# Altium schematic sheet Backplane PCB Connector.SchDoc: CUBESAT BACKPLANE PCB CONNECTOR
size B; CompanyName: ENGINEERING & TECHNICAL SERVICES; DrawnBy: C. Kornowski; Engineer: C. Kornowski; Organization: TECHNOLOGY DEVELOPMENT & ENGINEERING CENTER; Address1: 11401 HOOVER ROAD; Address2: MILAN, OH  44846; DocumentNumber: RD17-7000; Revision: INIT; SheetNumber: 2; SheetTotal: 5; PageSetup: Record=PageOptions|CenterHorizontal=True|CenterVertical=True|PrintScale=1.09|XCorrection=1.00|YCorrection=1.00|PrintKind=1|BorderSize=5000000|LeftOffset=0|BottomOffset=0|Orientation=2|PaperLength=1000|PaperWidth=1000|Scale=100|PaperSource=7|PrintQuality=600|MediaType=1|DitherType=10|PaperKind=11x17|PrintScaleMode=1
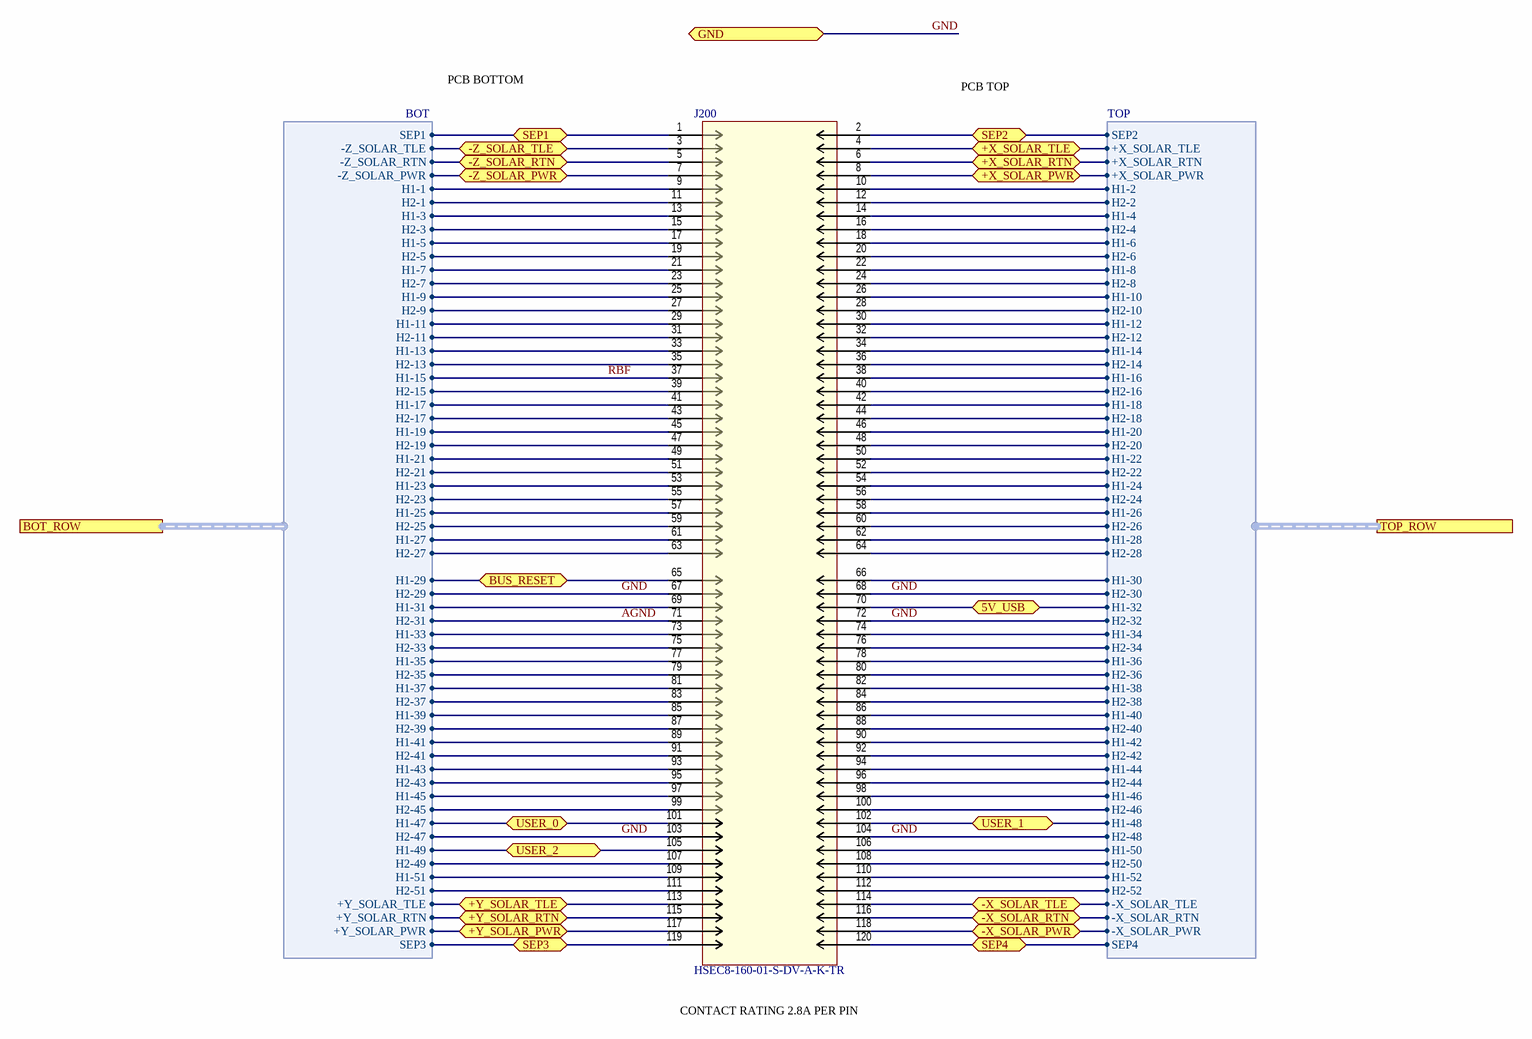
[diagram p0: Backplane PCB Connector.SchDoc]

## Parts
J200  HSEC8-160-01-S-DV-A-K-TR  [HSEC8-160-01-S-DV-A-K-TR]

## Ports
5V_USB (bidir), +X_SOLAR_PWR (bidir), +X_SOLAR_RTN (bidir), +X_SOLAR_TLE (bidir), +Y_SOLAR_PWR (bidir), +Y_SOLAR_RTN (bidir), +Y_SOLAR_TLE (bidir), -X_SOLAR_PWR (bidir), -X_SOLAR_RTN (bidir), -X_SOLAR_TLE (bidir), -Z_SOLAR_PWR (bidir), -Z_SOLAR_RTN (bidir), -Z_SOLAR_TLE (bidir), BOT_ROW (harness BOT), BUS_RESET (bidir), GND (bidir), SEP1 (bidir), SEP2 (bidir), SEP3 (bidir), SEP4 (bidir), TOP_ROW (harness TOP), USER_0 (bidir), USER_1 (bidir), USER_2 (bidir)

## Harnesses
BOT: H1-1, H2-1, H1-3, H2-3, H1-5, H2-5, H1-7, H2-7, H1-9, H2-9, H1-11, H2-11, H1-13, H2-13, H1-15, H2-15, H1-17, H2-17, H1-19, H2-19, H1-21, H2-21, H1-23, H2-23, H1-25, H2-25, H1-27, H2-27, H1-29, H2-29, H1-31, H2-31, H2-33, H1-33, H2-35, H1-35, H2-37, H1-37, H2-39, H1-39, H2-41, H1-41, H2-43, H1-43, H2-45, H1-45, H2-47, H1-47, H2-49, H1-49, H2-51, H1-51, SEP1, SEP3, +Y_SOLAR_PWR, +Y_SOLAR_RTN, +Y_SOLAR_TLE, -Z_SOLAR_PWR, -Z_SOLAR_RTN, -Z_SOLAR_TLE
TOP: H1-2, H2-2, H1-4, H2-4, H1-6, H2-6, H1-8, H2-8, H1-10, H2-10, H1-12, H2-12, H1-14, H2-14, H1-16, H2-16, H1-18, H2-18, H1-20, H2-20, H1-22, H2-22, H1-24, H2-24, H1-26, H2-26, H1-28, H2-28, H1-30, H2-30, H2-32, H1-32, H2-34, H1-34, H2-36, H1-36, H2-38, H1-38, H2-40, H1-40, H2-42, H1-42, H2-44, H1-44, H2-46, H1-46, H2-48, H1-48, H2-50, H1-50, H2-52, H1-52, SEP2, SEP4, -X_SOLAR_PWR, -X_SOLAR_RTN, -X_SOLAR_TLE, +X_SOLAR_TLE, +X_SOLAR_RTN, +X_SOLAR_PWR

## Nets
5V_USB: J200.70 ; port 5V_USB, port TOP_ROW.H1-32
+X_SOLAR_PWR: J200.8 ; port +X_SOLAR_PWR, port TOP_ROW.+X_SOLAR_PWR
+X_SOLAR_RTN: J200.6 ; port +X_SOLAR_RTN, port TOP_ROW.+X_SOLAR_RTN
+X_SOLAR_TLE: J200.4 ; port +X_SOLAR_TLE, port TOP_ROW.+X_SOLAR_TLE
+Y_SOLAR_PWR: J200.117 ; port +Y_SOLAR_PWR, port BOT_ROW.+Y_SOLAR_PWR
+Y_SOLAR_RTN: J200.115 ; port +Y_SOLAR_RTN, port BOT_ROW.+Y_SOLAR_RTN
+Y_SOLAR_TLE: J200.113 ; port +Y_SOLAR_TLE, port BOT_ROW.+Y_SOLAR_TLE
-X_SOLAR_PWR: J200.118 ; port -X_SOLAR_PWR, port TOP_ROW.-X_SOLAR_PWR
-X_SOLAR_RTN: J200.116 ; port -X_SOLAR_RTN, port TOP_ROW.-X_SOLAR_RTN
-X_SOLAR_TLE: J200.114 ; port -X_SOLAR_TLE, port TOP_ROW.-X_SOLAR_TLE
-Z_SOLAR_PWR: J200.7 ; port -Z_SOLAR_PWR, port BOT_ROW.-Z_SOLAR_PWR
-Z_SOLAR_RTN: J200.5 ; port -Z_SOLAR_RTN, port BOT_ROW.-Z_SOLAR_RTN
-Z_SOLAR_TLE: J200.3 ; port -Z_SOLAR_TLE, port BOT_ROW.-Z_SOLAR_TLE
AGND: J200.71 ; port BOT_ROW.H2-31
BUS_RESET: J200.65 ; port BUS_RESET, port BOT_ROW.H1-29
GND: J200.67 J200.68 J200.72 J200.103 J200.104 ; port GND, port BOT_ROW.H2-29, port BOT_ROW.H2-47, port TOP_ROW.H2-30, port TOP_ROW.H2-32, port TOP_ROW.H2-48
RBF: J200.37 ; port BOT_ROW.H1-15
SEP1: J200.1 ; port SEP1, port BOT_ROW.SEP1
SEP2: J200.2 ; port SEP2, port TOP_ROW.SEP2
SEP3: J200.119 ; port SEP3, port BOT_ROW.SEP3
SEP4: J200.120 ; port SEP4, port TOP_ROW.SEP4
USER_0: J200.101 ; port USER_0, port BOT_ROW.H1-47
USER_1: J200.102 ; port USER_1, port TOP_ROW.H1-48
USER_2: J200.105 ; port USER_2, port BOT_ROW.H1-49
NetJ200_9: J200.9 ; port BOT_ROW.H1-1
NetJ200_10: J200.10 ; port TOP_ROW.H1-2
NetJ200_11: J200.11 ; port BOT_ROW.H2-1
NetJ200_12: J200.12 ; port TOP_ROW.H2-2
NetJ200_13: J200.13 ; port BOT_ROW.H1-3
NetJ200_14: J200.14 ; port TOP_ROW.H1-4
NetJ200_15: J200.15 ; port BOT_ROW.H2-3
NetJ200_16: J200.16 ; port TOP_ROW.H2-4
NetJ200_17: J200.17 ; port BOT_ROW.H1-5
NetJ200_18: J200.18 ; port TOP_ROW.H1-6
NetJ200_19: J200.19 ; port BOT_ROW.H2-5
NetJ200_20: J200.20 ; port TOP_ROW.H2-6
NetJ200_21: J200.21 ; port BOT_ROW.H1-7
NetJ200_22: J200.22 ; port TOP_ROW.H1-8
NetJ200_23: J200.23 ; port BOT_ROW.H2-7
NetJ200_24: J200.24 ; port TOP_ROW.H2-8
NetJ200_25: J200.25 ; port BOT_ROW.H1-9
NetJ200_26: J200.26 ; port TOP_ROW.H1-10
NetJ200_27: J200.27 ; port BOT_ROW.H2-9
NetJ200_28: J200.28 ; port TOP_ROW.H2-10
NetJ200_29: J200.29 ; port BOT_ROW.H1-11
NetJ200_30: J200.30 ; port TOP_ROW.H1-12
NetJ200_31: J200.31 ; port BOT_ROW.H2-11
NetJ200_32: J200.32 ; port TOP_ROW.H2-12
NetJ200_33: J200.33 ; port BOT_ROW.H1-13
NetJ200_34: J200.34 ; port TOP_ROW.H1-14
NetJ200_35: J200.35 ; port BOT_ROW.H2-13
NetJ200_36: J200.36 ; port TOP_ROW.H2-14
NetJ200_38: J200.38 ; port TOP_ROW.H1-16
NetJ200_39: J200.39 ; port BOT_ROW.H2-15
NetJ200_40: J200.40 ; port TOP_ROW.H2-16
NetJ200_41: J200.41 ; port BOT_ROW.H1-17
NetJ200_42: J200.42 ; port TOP_ROW.H1-18
NetJ200_43: J200.43 ; port BOT_ROW.H2-17
NetJ200_44: J200.44 ; port TOP_ROW.H2-18
NetJ200_45: J200.45 ; port BOT_ROW.H1-19
NetJ200_46: J200.46 ; port TOP_ROW.H1-20
NetJ200_47: J200.47 ; port BOT_ROW.H2-19
NetJ200_48: J200.48 ; port TOP_ROW.H2-20
NetJ200_49: J200.49 ; port BOT_ROW.H1-21
NetJ200_50: J200.50 ; port TOP_ROW.H1-22
NetJ200_51: J200.51 ; port BOT_ROW.H2-21
NetJ200_52: J200.52 ; port TOP_ROW.H2-22
NetJ200_53: J200.53 ; port BOT_ROW.H1-23
NetJ200_54: J200.54 ; port TOP_ROW.H1-24
NetJ200_55: J200.55 ; port BOT_ROW.H2-23
NetJ200_56: J200.56 ; port TOP_ROW.H2-24
NetJ200_57: J200.57 ; port BOT_ROW.H1-25
NetJ200_58: J200.58 ; port TOP_ROW.H1-26
NetJ200_59: J200.59 ; port BOT_ROW.H2-25
NetJ200_60: J200.60 ; port TOP_ROW.H2-26
NetJ200_61: J200.61 ; port BOT_ROW.H1-27
NetJ200_62: J200.62 ; port TOP_ROW.H1-28
NetJ200_63: J200.63 ; port BOT_ROW.H2-27
NetJ200_64: J200.64 ; port TOP_ROW.H2-28
NetJ200_66: J200.66 ; port TOP_ROW.H1-30
NetJ200_69: J200.69 ; port BOT_ROW.H1-31
NetJ200_73: J200.73 ; port BOT_ROW.H1-33
NetJ200_74: J200.74 ; port TOP_ROW.H1-34
NetJ200_75: J200.75 ; port BOT_ROW.H2-33
NetJ200_76: J200.76 ; port TOP_ROW.H2-34
NetJ200_77: J200.77 ; port BOT_ROW.H1-35
NetJ200_78: J200.78 ; port TOP_ROW.H1-36
NetJ200_79: J200.79 ; port BOT_ROW.H2-35
NetJ200_80: J200.80 ; port TOP_ROW.H2-36
NetJ200_81: J200.81 ; port BOT_ROW.H1-37
NetJ200_82: J200.82 ; port TOP_ROW.H1-38
NetJ200_83: J200.83 ; port BOT_ROW.H2-37
NetJ200_84: J200.84 ; port TOP_ROW.H2-38
NetJ200_85: J200.85 ; port BOT_ROW.H1-39
NetJ200_86: J200.86 ; port TOP_ROW.H1-40
NetJ200_87: J200.87 ; port BOT_ROW.H2-39
NetJ200_88: J200.88 ; port TOP_ROW.H2-40
NetJ200_89: J200.89 ; port BOT_ROW.H1-41
NetJ200_90: J200.90 ; port TOP_ROW.H1-42
NetJ200_91: J200.91 ; port BOT_ROW.H2-41
NetJ200_92: J200.92 ; port TOP_ROW.H2-42
NetJ200_93: J200.93 ; port BOT_ROW.H1-43
NetJ200_94: J200.94 ; port TOP_ROW.H1-44
NetJ200_95: J200.95 ; port BOT_ROW.H2-43
NetJ200_96: J200.96 ; port TOP_ROW.H2-44
NetJ200_97: J200.97 ; port BOT_ROW.H1-45
NetJ200_98: J200.98 ; port TOP_ROW.H1-46
NetJ200_99: J200.99 ; port BOT_ROW.H2-45
NetJ200_100: J200.100 ; port TOP_ROW.H2-46
NetJ200_106: J200.106 ; port TOP_ROW.H1-50
NetJ200_107: J200.107 ; port BOT_ROW.H2-49
NetJ200_108: J200.108 ; port TOP_ROW.H2-50
NetJ200_109: J200.109 ; port BOT_ROW.H1-51
NetJ200_110: J200.110 ; port TOP_ROW.H1-52
NetJ200_111: J200.111 ; port BOT_ROW.H2-51
NetJ200_112: J200.112 ; port TOP_ROW.H2-52

## Notes on the sheet
- PCB BOTTOM
- PCB TOP
- CONTACT RATING 2.8A PER PIN
- DCN
- REV
- DESCRIPTION
- REVISION HISTORY
- DATE
- APPROVED
- SIZE
- TITLE
- CAGE CODE
- DWG NO.
- DRAWN BY
- B
- 01HY9
- ENGINEER
- FILE NAME
- SHEET
- PRINTED:
- OF

## Library data of the parts
J200 = HSEC8-160-01-S-DV-A-K-TR: 120 Position Female Connector Non Specified - Dual Edge Gold 0.031" (0.80mm) Black; Manufacturer 1: Samtec; Max Current Rating: 3.1A; Number of Positions: 120; Connector Type: Cantilever; Pitch: 0.8mm; Card Thickness: 0.062inch; Supplier 1: Digi-Key; Supplier Part Number 1: SAM13191CT-ND; Stock 1: 14; Pricing 1: 1=7.87000, 10=7.53900, 25=6.88400, 50=6.55600, 100=6.22820 (USD); RoHS: Yes; Mount: Surface Mount; Contact Plating: Gold; Contact Material: Copper; Color: Black; Housing Color: Black; Insulation Material: Polymer; Housing Material: Polymer; Min Operating Temperature: -55°C; Max Operating Temperature: 125°C; Packaging: Tape and Reel; Number of Rows: 2; Gender: Female; Termination: Solder; Number of Contacts: 120; Orientation: Straight; Radiation Hardening: No; ComponentLink1URL: https://datasheet.ciiva.com/10924/hsec8-dv-10924587.pdf?src-supplier=Avnet; ComponentLink1Description: https://datasheet.ciiva.com/10924/hsec8-dv-10924587.pdf?src-supplier=Avnet; ComponentLink2URL: https://datasheet.ciiva.com/437/hsec8-1xxx-xx-xx-dv-x-xx-mkt-437503.pdf?src-supplier=Digi-Key; ComponentLink2Description: https://datasheet.ciiva.com/437/hsec8-1xxx-xx-xx-dv-x-xx-mkt-437503.pdf?src-supplier=Digi-Key; ComponentLink3URL: https://datasheet.ciiva.com/16666/hsec8-dv-16666399.pdf?src-supplier=Avnet+Europe; ComponentLink3Description: https://datasheet.ciiva.com/16666/hsec8-dv-16666399.pdf?src-supplier=Avnet+Europe; Manufacturer Part Number 1: HSEC8-160-01-S-DV-A-K-TR; System: Connector